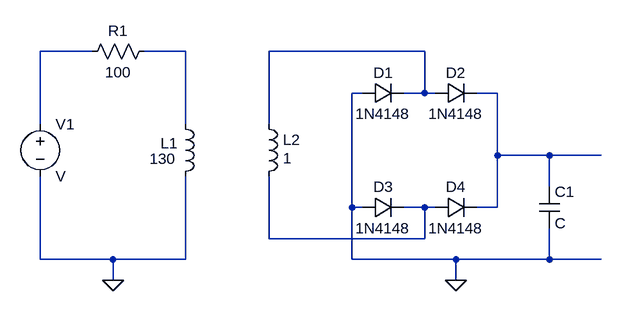
[diagram p0: schematic Unregulated_Sim.asc]
Unregulated_Sim.asc, the LTspice schematic file:
Version 4.1
SHEET 1 880 680
WIRE 16 32 -64 32
WIRE 160 32 96 32
WIRE 528 32 288 32
WIRE 432 96 416 96
WIRE 528 96 528 32
WIRE 528 96 496 96
WIRE 544 96 528 96
WIRE 640 96 608 96
WIRE -64 144 -64 32
WIRE 160 144 160 32
WIRE 288 144 288 32
WIRE 640 192 640 96
WIRE 720 192 640 192
WIRE 800 192 720 192
WIRE 720 240 720 192
WIRE 416 272 416 96
WIRE 432 272 416 272
WIRE 528 272 496 272
WIRE 544 272 528 272
WIRE 640 272 640 192
WIRE 640 272 608 272
WIRE 288 320 288 224
WIRE 528 320 528 272
WIRE 528 320 288 320
WIRE -64 352 -64 224
WIRE 48 352 -64 352
WIRE 160 352 160 224
WIRE 160 352 48 352
WIRE 416 352 416 272
WIRE 576 352 416 352
WIRE 720 352 720 304
WIRE 720 352 576 352
WIRE 800 352 720 352
WIRE 48 384 48 352
WIRE 576 384 576 352
FLAG 48 384 0
FLAG 576 384 0
SYMBOL voltage -64 128 R0
SYMATTR InstName V1
SYMBOL ind 144 128 R0
WINDOW 0 -23 45 Left 2
WINDOW 3 -40 69 Left 2
SYMATTR InstName L1
SYMATTR Value 130
SYMATTR SpiceLine Rser=1m
SYMBOL ind 272 128 R0
WINDOW 0 38 40 Left 2
WINDOW 3 38 68 Left 2
SYMATTR InstName L2
SYMATTR Value 1
SYMATTR SpiceLine Rser=1m
SYMBOL res 112 16 R90
WINDOW 0 0 56 VBottom 2
WINDOW 3 32 56 VTop 2
SYMATTR InstName R1
SYMATTR Value 100
SYMBOL diode 432 112 R270
WINDOW 0 32 32 VTop 2
WINDOW 3 0 32 VBottom 2
SYMATTR InstName D1
SYMATTR Value 1N4148
SYMBOL diode 544 112 R270
WINDOW 0 32 32 VTop 2
WINDOW 3 0 32 VBottom 2
SYMATTR InstName D2
SYMATTR Value 1N4148
SYMBOL diode 432 288 R270
WINDOW 0 32 32 VTop 2
WINDOW 3 0 32 VBottom 2
SYMATTR InstName D3
SYMATTR Value 1N4148
SYMBOL diode 544 288 R270
WINDOW 0 32 32 VTop 2
WINDOW 3 0 32 VBottom 2
SYMATTR InstName D4
SYMATTR Value 1N4148
SYMBOL cap 704 240 R0
SYMATTR InstName C1

The netlist it stands for:
* Unregulated_Sim.asc
V1 N001 0 V
L1 N002 0 130 Rser=1m
L2 N003 N005 1 Rser=1m
R1 N002 N001 100
D1 0 N003 1N4148
D2 N003 N004 1N4148
D3 0 N005 1N4148
D4 N005 N004 1N4148
C1 N004 0 C
.model D D
.lib standard.dio
.backanno
.end